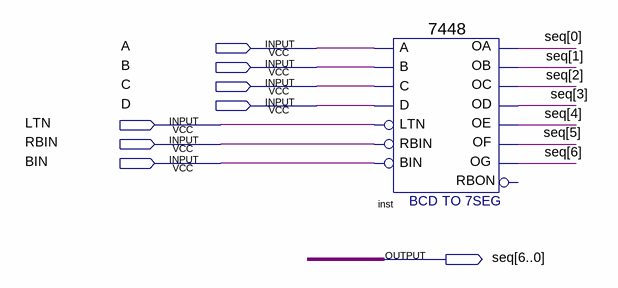
[diagram p0: schematic sheet]
// Quartus schematic lab1.bdf as structural Verilog: 1 symbols, 8 pins
module lab1 (
  input  A,
  input  B,
  input  C,
  input  D,
  input  LTN,
  input  RBIN,
  input  BIN,
  output [6:0] seq
);

  \7448  inst (
    .A(A), .C(C), .D(D), .B(B), .RBIN(RBIN), .BIN(BIN), .LTN(LTN), .OC(seq[2]), .OE(seq[4]), .OD(seq[3]),
    .OF(seq[5]), .OG(seq[6]), .OB(seq[1]), .OA(seq[0]));  // open: RBON
endmodule
